# Altium project GREENBOX-ACC-J16-PVT2-TESTBOARD.PrjPCB
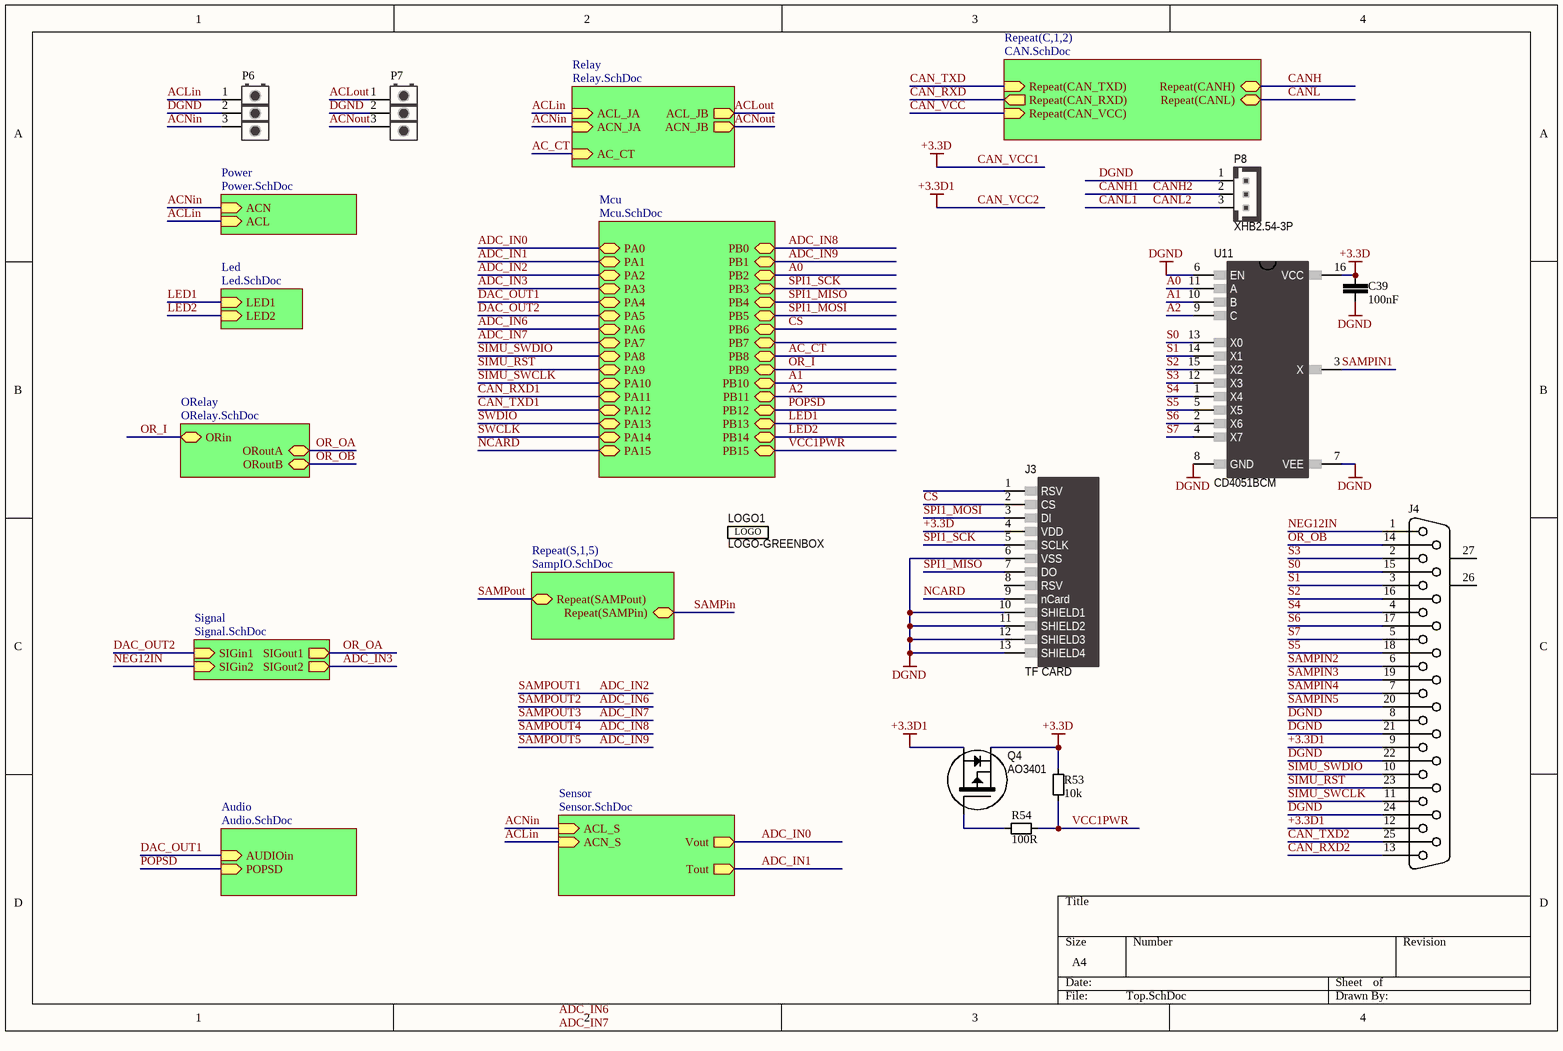
[diagram p0: Top.SchDoc]
11 sheets, 166 parts. Net scope: hierarchical (ports join the sheet entries above them; power ports are global).
Board file: J16-TESTBOARD.PcbDoc
Sheets:
  Top.SchDoc
    Mcu = Mcu.SchDoc
    Led = Led.SchDoc
    Power = Power.SchDoc
    ORelay = ORelay.SchDoc
    Sensor = Sensor.SchDoc
    C1 = CAN.SchDoc
    C2 = CAN.SchDoc
    Audio = Audio.SchDoc
    Signal = Signal.SchDoc
    Relay = Relay.SchDoc
    S1 = SampIO.SchDoc
    S2 = SampIO.SchDoc
    S3 = SampIO.SchDoc
    S4 = SampIO.SchDoc
    S5 = SampIO.SchDoc

## Sheet Top.SchDoc
size A4

### Parts
C39  value 100nF  [0603-C]  (hidden comment: Cap)
J3  TF CARD  [TF-2]
J4  DB25  [DB25F]  (value not drawn)
LOGO1  LOGO-GREENBOX  [LOGO-GREENBOX]
P6  KF7.62-3P  [KF762-3]  (value not drawn)
P7  KF7.62-3P  [KF762-3]  (value not drawn)
P8  XHB2.54-3P  [XH-3]
Q4  AO3401  [SOT-23_N]
R53  value 10k  [0603-R]  (hidden comment: Res)
R54  value 100R  [0603-R]  (hidden comment: Res)
U11  CD4051BCM  [SO-16_N]

### Sub-sheets
Audio = Audio.SchDoc: AUDIOin (in), POPSD (in)
Led = Led.SchDoc: LED1 (in), LED2 (in)
Mcu = Mcu.SchDoc: PA0, PA1, PA2, PA3, PA4, PA5, PA6, PA7, PA8, PA9, PA10, PA11, PA12, PA13, PA14, PA15, PB0, PB1, PB2, PB3, PB4, PB5, PB6, PB7, PB8, PB9, PB10, PB11, PB12, PB13, PB14, PB15
ORelay = ORelay.SchDoc: ORin, ORoutA, ORoutB
Power = Power.SchDoc: ACN (in), ACL (in)
Relay = Relay.SchDoc: ACL_JA (in), ACN_JA (in), ACL_JB (out), ACN_JB (out), AC_CT (in)
Repeat(C,1,2) = CAN.SchDoc: Repeat(CAN_TXD) (in), Repeat(CAN_RXD) (out), Repeat(CANH) (bidir), Repeat(CANL) (bidir), Repeat(CAN_VCC) (in)
Repeat(S,1,5) = SampIO.SchDoc: Repeat(SAMPout), Repeat(SAMPin)
Sensor = Sensor.SchDoc: Vout (out), Tout (out), ACL_S (in), ACN_S (in)
Signal = Signal.SchDoc: SIGin2 (in), SIGout1 (out), SIGin1 (in), SIGout2 (out)

### Nets
+3.3D: C39.1 J3.4(VDD) Q4.2(S) R53.1 U11.16(VCC)  [also labelled CAN_VCC1]
+3.3D1: J4.9 J4.12 Q4.3(D)  [also labelled CAN_VCC2]
DGND: C39.2 J3.6(VSS) J3.10(SHIELD1) J3.11(SHIELD2) J3.12(SHIELD3) J3.13(SHIELD4) J4.8 J4.21 J4.22 J4.24 P6.2 P7.2 P8.1 U11.6(EN) U11.7(VEE) U11.8(GND)
A0: U11.11(A) ; sheet Mcu/PB2
A1: U11.10(B) ; sheet Mcu/PB10
A2: U11.9(C) ; sheet Mcu/PB11
AC_CT: sheet Mcu/PB8, sheet Relay/AC_CT
ACLin: P6.1 ; sheet Power/ACL, sheet Sensor/ACN_S, sheet Relay/ACL_JA
ACLout: P7.1 ; sheet Relay/ACL_JB
ACNin: P6.3 ; sheet Power/ACN, sheet Sensor/ACL_S, sheet Relay/ACN_JA
ACNout: P7.3 ; sheet Relay/ACN_JB
ADC_IN0: sheet Mcu/PA0, sheet Sensor/Vout
ADC_IN1: sheet Mcu/PA1, sheet Sensor/Tout
ADC_IN3: sheet Mcu/PA3, sheet Signal/SIGout2
CAN_RXD: sheet Repeat(C,1,2)/Repeat(CAN_RXD)
CAN_RXD2: J4.13
CAN_TXD: sheet Repeat(C,1,2)/Repeat(CAN_TXD)
CAN_TXD2: J4.25
CAN_VCC: sheet Repeat(C,1,2)/Repeat(CAN_VCC)
CANH: sheet Repeat(C,1,2)/Repeat(CANH)
CANH1: P8.2  [also labelled CANH2]
CANL: sheet Repeat(C,1,2)/Repeat(CANL)
CANL1: P8.3  [also labelled CANL2]
CS: J3.2(CS) ; sheet Mcu/PB6
DAC_OUT1: sheet Mcu/PA4, sheet Audio/AUDIOin
DAC_OUT2: sheet Mcu/PA5, sheet Signal/SIGin1
LED1: sheet Mcu/PB13, sheet Led/LED1
LED2: sheet Mcu/PB14, sheet Led/LED2
NCARD: J3.9(nCard) ; sheet Mcu/PA15
NEG12IN: J4.1 ; sheet Signal/SIGin2
OR_I: sheet Mcu/PB9, sheet ORelay/ORin
OR_OA: sheet ORelay/ORoutA, sheet Signal/SIGout1
OR_OB: J4.14 ; sheet ORelay/ORoutB
POPSD: sheet Mcu/PB12, sheet Audio/POPSD
S0: J4.15 U11.13(X0)
S1: J4.3 U11.14(X1)
S2: J4.16 U11.15(X2)
S3: J4.2 U11.12(X3)
S4: J4.4 U11.1(X4)
S5: J4.18 U11.5(X5)
S6: J4.17 U11.2(X6)
S7: J4.5 U11.4(X7)
SAMPin: sheet Repeat(S,1,5)/Repeat(SAMPin)
SAMPIN1: U11.3(X)
SAMPIN2: J4.6
SAMPIN3: J4.19
SAMPIN4: J4.7
SAMPIN5: J4.20
SAMPout: sheet Repeat(S,1,5)/Repeat(SAMPout)
SIMU_RST: J4.23 ; sheet Mcu/PA9
SIMU_SWCLK: J4.11 ; sheet Mcu/PA10
SIMU_SWDIO: J4.10 ; sheet Mcu/PA8
SPI1_MISO: J3.7(DO) ; sheet Mcu/PB4
SPI1_MOSI: J3.3(DI) ; sheet Mcu/PB5
SPI1_SCK: J3.5(SCLK) ; sheet Mcu/PB3
VCC1PWR: R53.2 R54.2 ; sheet Mcu/PB15
NetQ4_1: Q4.1(G) R54.1

Not connected (* = marked no-connect by the designer): J3 1(RSV) 8(RSV); J4 26(MH1) 27(MH2)

### Notes on the sheet
- Labels drawn without touching a wire or pin: ADC_IN6, ADC_IN7
- (in symbol LOGO1) LOGO

### Library data of the parts
C39 = C21C100NK1H0: MLCC 100nF 10% 50V X7R 0603; TemperatureRange: -55°C to 150°C; VenderID: MLCC-0603-50V-104K-X7R; Published: 1-Jun-2017; Publisher: GreenBox; MountType: SMT; PackageReference: 0603; Manufacturer: *
J3 = M3DZTF2SPI00: TF CARD Pudsh-Push SPIMode; Manufacturer: TEXAS INSTRUMENTS; VenderID: TF卡座自弹式; Publisher: GreenBox; Published: 1-Jun-2017; PackageReference: TF-2; MountType: SMT; TemperatureRange: *
J4 = PDDD25Z27700: Receptacle Assembly DB25 Vertical; Publisher: GreenBox; Published: 1-Jan-2017; MountType: DIP; PackageReference: DB25F; VenderID: DB25 Vertical; TemperatureRange: *
LOGO1 = LOGO1: Resettable Fuse SMD1206P050TF 1206 500mA; Manufacturer: *; MountType: *; PackageDescription: *; PackageReference: *; Published: 1-Jun-2017; Publisher: GreenBox; TemperatureRange: *; VenderID: *
P6 P7 = PKDK03Z76200: Header KF7.62-3P 7.62mm; Publisher: GreenBox; Published: 1-Jan-2017; MountType: DIP; PackageReference: KF7.62-3P; VenderID: KF7.62-3P; TemperatureRange: *
P8 = P6DX03Z25400: Header XHB2.54-3P 2.54mm; TemperatureRange: -25 to 85°C; Manufacturer: *; MountType: DIP; PackageReference: XH2.54-3P; Published: 1-Jun-2017; Publisher: GreenBox; VenderID: XHB2.54-3P
Q4 = QP42AO34010A: P-Channel MOSFET AO3401 -30V -4.2A; Manufacturer: ALPHA&OMEGA; TemperatureRange: -55 to 150°C; MountType: SMT; PackageReference: SOT-23; Published: 1-Jun-2017; Publisher: GreenBox; VenderID: AO3401
R53 = R11C010KFBF0: SMD Resistor 10k 1% 1/10W 0603 100PPM; TemperatureRange: -55°C to 150°C; VenderID: RES-0603-10k-1%; Published: 1-Jun-2017; Publisher: GreenBox; MountType: SMT; PackageReference: 0603; Manufacturer: *
R54 = R11C100RFBF0: SMD Resistor 100R 1% 1/10W 0603 100PPM; TemperatureRange: -55°C to 150°C; VenderID: RES-0603-100R-1%; Published: 1-Jun-2017; Publisher: GreenBox; MountType: SMT; PackageReference: 0603; Manufacturer: *
U11 = UCS3CD4051B0: SGL ENDED MULTIPLEXER CD4051BCM 8-CHANNEL; TemperatureRange: -55 to 125°C; Manufacturer: *; MountType: SMT; PackageReference: SOIC-16; Published: 1-Jun-2017; Publisher: GreenBox; VenderID: CD4051BCM

## Sheet Mcu.SchDoc
size A4
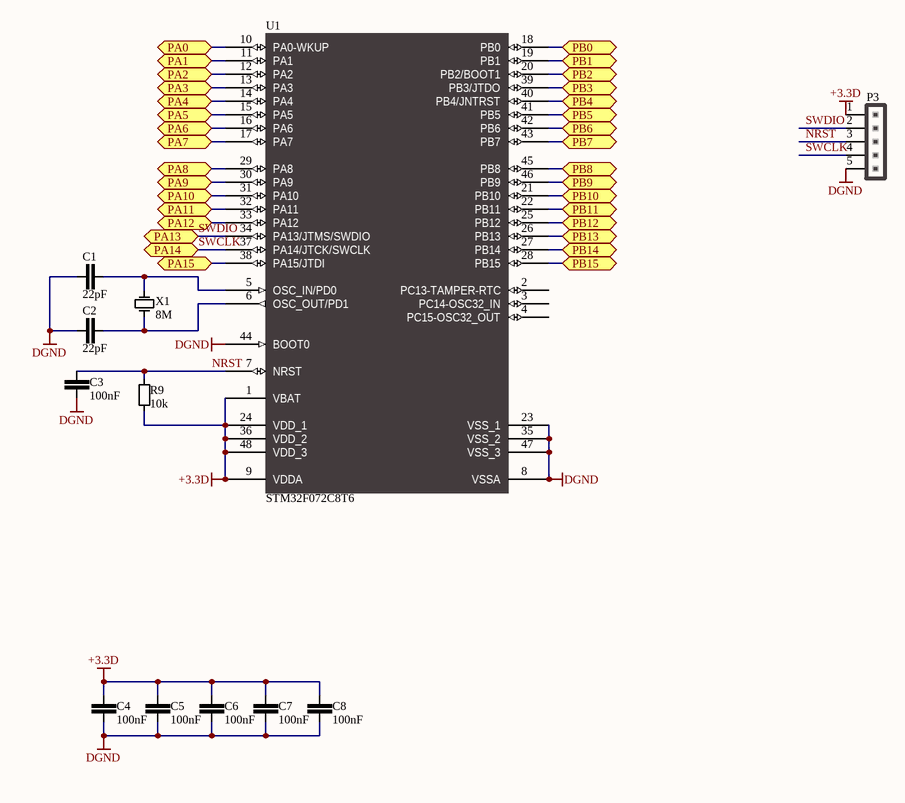
[diagram p1: Mcu.SchDoc]

### Parts
C1  value 22pF  [0603-C]  (hidden comment: Cap)
C2  value 22pF  [0603-C]  (hidden comment: Cap)
C3  value 100nF  [0603-C]  (hidden comment: Cap)
C4  value 100nF  [0603-C]  (hidden comment: Cap)
C5  value 100nF  [0603-C]  (hidden comment: Cap)
C6  value 100nF  [0603-C]  (hidden comment: Cap)
C7  value 100nF  [0603-C]  (hidden comment: Cap)
C8  value 100nF  [0603-C]  (hidden comment: Cap)
P3  Header 5  [HDR-1X5]  (value not drawn)
R9  value 10k  [0603-R]  (hidden comment: Res)
U1  STM32F072C8T6  [LQFP48_N]
X1  value 8M  [5032]  (hidden comment: Crystal)

### Ports
PA0, PA1, PA2, PA3, PA4, PA5, PA6, PA7, PA8, PA9, PA10, PA11, PA12, PA13, PA14, PA15, PB0, PB1, PB2, PB3, PB4, PB5, PB6, PB7, PB8, PB9, PB10, PB11, PB12, PB13, PB14, PB15

### Nets
+3.3D: C4.1 C5.1 C6.1 C7.1 C8.1 P3.1 R9.2 U1.1(VBAT) U1.9(VDDA) U1.24(VDD_1) U1.36(VDD_2) U1.48(VDD_3)
DGND: C1.1 C2.1 C3.1 C4.2 C5.2 C6.2 C7.2 C8.2 P3.5 U1.8(VSSA) U1.23(VSS_1) U1.35(VSS_2) U1.44(BOOT0) U1.47(VSS_3)
A0: U1.20(PB2/BOOT1) ; port PB2
A1: U1.21(PB10) ; port PB10
A2: U1.22(PB11) ; port PB11
AC_CT: U1.45(PB8) ; port PB8
ADC_IN0: U1.10(PA0-WKUP) ; port PA0
ADC_IN1: U1.11(PA1) ; port PA1
ADC_IN2: U1.12(PA2) ; port PA2
ADC_IN3: U1.13(PA3) ; port PA3
ADC_IN6: U1.16(PA6) ; port PA6
ADC_IN7: U1.17(PA7) ; port PA7
ADC_IN8: U1.18(PB0) ; port PB0
ADC_IN9: U1.19(PB1) ; port PB1
CAN_RXD1: U1.32(PA11) ; port PA11
CAN_TXD1: U1.33(PA12) ; port PA12
CS: U1.42(PB6) ; port PB6
DAC_OUT1: U1.14(PA4) ; port PA4
DAC_OUT2: U1.15(PA5) ; port PA5
LED1: U1.26(PB13) ; port PB13
LED2: U1.27(PB14) ; port PB14
NCARD: U1.38(PA15/JTDI) ; port PA15
NRST: C3.2 P3.3 R9.1 U1.7(NRST)
OR_I: U1.46(PB9) ; port PB9
POPSD: U1.25(PB12) ; port PB12
SIMU_RST: U1.30(PA9) ; port PA9
SIMU_SWCLK: U1.31(PA10) ; port PA10
SIMU_SWDIO: U1.29(PA8) ; port PA8
SPI1_MISO: U1.40(PB4/JNTRST) ; port PB4
SPI1_MOSI: U1.41(PB5) ; port PB5
SPI1_SCK: U1.39(PB3/JTDO) ; port PB3
SWCLK: P3.4 U1.37(PA14/JTCK/SWCLK) ; port PA14
SWDIO: P3.2 U1.34(PA13/JTMS/SWDIO) ; port PA13
VCC1PWR: U1.28(PB15) ; port PB15
NetC1_2: C1.2 U1.5(OSC_IN/PD0) X1.2(OSC2)
NetC2_2: C2.2 U1.6(OSC_OUT/PD1) X1.1(OSC1)
NetU1_43: U1.43(PB7) ; port PB7

Not connected (* = marked no-connect by the designer): U1 2(PC13-TAMPER-RTC) 3(PC14-OSC32_IN) 4(PC15-OSC32_OUT)

### Library data of the parts
C1 C2 = C11C022PJ1H0: MLCC 22pF 5% 50V NPO 0603; TemperatureRange: -55°C to 150°C; VenderID: MLCC-0603-50V-220J-NPO; Published: 1-Jun-2017; Publisher: GreenBox; MountType: SMT; PackageReference: 0603; Manufacturer: *
C3-C8 = C21C100NK1H0: as C39 on sheet Top; Published: 1-Jun-2017; Publisher: GreenBox; MountType: SMT; PackageReference: 0603; Manufacturer: *
P3 = P1D105Z254D0: Header 5-Pin Pitch 2.54mm Height 11mm; VenderID: 单排针2.54mm针长11mm; Publisher: GreenBox; Published: 1-Jun-2017; MountType: DIP; PackageReference: HDR5X1; TemperatureRange: *; Manufacturer: *
R9 = R11c010KFBF0: SMD Resistor 10k 1% 1/10W 0603 100PPM; TemperatureRange: -55°C to 150°C; VenderID: RES-0603-10k-1%; Published: 1-Jun-2017; Publisher: GreenBox; MountType: SMT; PackageReference: 0603; Manufacturer: *
U1 = UML3072C8T6S: ARM CORTEXM3 STM32F072C8T6; Manufacturer: ST; TemperatureRange: -40 to 85°C; Published: 1-Jun-2017; PackageReference: LQFP48; Publisher: GreenBox; PackageDescription: Thin QFP, 48-Leads, Body 7x7mm, Pitch 0.5mm; MountType: SMT; VenderID: STM32F072C8T6
X1 = XC23000008M1: Crystal 8M 5032 50PPM; Manufacturer: NDK; VenderID: NX5032GA-8.000M-STD-CSU-1; TemperatureRange: -40 to 150°C; PackageReference: 5032; Publisher: GreenBox; Published: 1-Jun-2017; MountType: SMT; PackageDescription: 5032; Body 5.0 x 3.2 x 1.2 mm

## Sheet Led.SchDoc
size A4
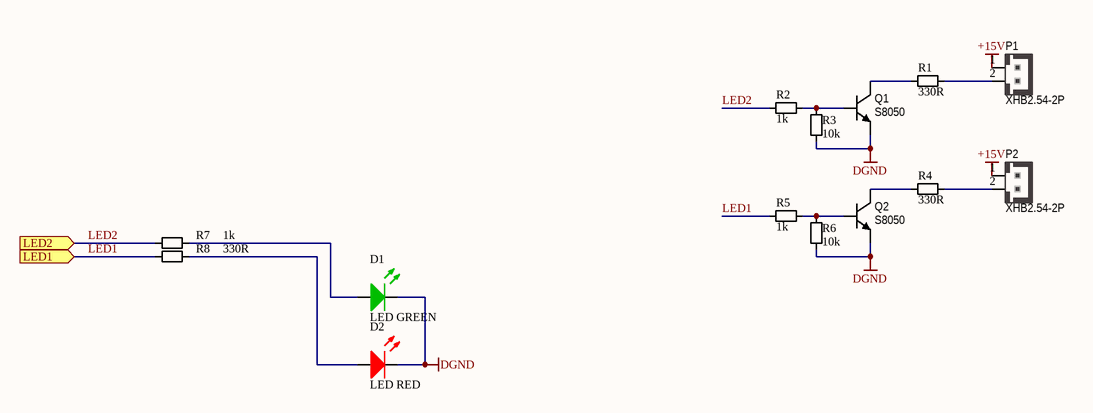
[diagram p2: Led.SchDoc]

### Parts
D1  LED GREEN  [0805-LED-G]
D2  LED RED  [0805-LED-R]
P1  XHB2.54-2P  [XH-2]
P2  XHB2.54-2P  [XH-2]
Q1  S8050  [SOT-23_N]
Q2  S8050  [SOT-23_N]
R1  value 330R  [0603-R]  (hidden comment: Res)
R2  value 1k  [0603-R]  (hidden comment: Res)
R3  value 10k  [0603-R]  (hidden comment: Res)
R4  value 330R  [0603-R]  (hidden comment: Res)
R5  value 1k  [0603-R]  (hidden comment: Res)
R6  value 10k  [0603-R]  (hidden comment: Res)
R7  value 1k  [0603-R]  (hidden comment: Res)
R8  value 330R  [0603-R]  (hidden comment: Res)

### Ports
LED1 (in), LED2 (in)

### Nets
+15V: P1.1 P2.1
DGND: D1.2 D2.2 Q1.2(E) Q2.2(E) R3.2 R6.2
LED1: R5.1 R8.1 ; port LED1
LED2: R2.1 R7.1 ; port LED2
NetD1_1: D1.1 R7.2
NetD2_1: D2.1 R8.2
NetP1_2: P1.2 R1.2
NetP2_2: P2.2 R4.2
NetQ1_1: Q1.1(B) R2.2 R3.1
NetQ1_3: Q1.3(C) R1.1
NetQ2_1: Q2.1(B) R5.2 R6.1
NetQ2_3: Q2.3(C) R4.1

### Library data of the parts
D1 = D614000000G0: LIGHT EMITTING DIODE 0805 GREEN; TemperatureRange: -30 to 85°C; VenderID: LED-0805-GREEN; Published: 1-Jun-2017; Publisher: GreenBox; PackageReference: 0805; MountType: SMT; Manufacturer: *
D2 = D614000000R0: LIGHT EMITTING DIODE 0805 RED; TemperatureRange: -30 to 85°C; VenderID: LED-0805-RED; Published: 1-Jun-2017; Publisher: GreenBox; PackageReference: 0805; MountType: SMT; Manufacturer: *
P1 P2 = P6DX02Z25400: Header XHB2.54-2P 2.54mm; TemperatureRange: -25 to 85°C; Manufacturer: *; MountType: DIP; PackageReference: XH2.54-2P; Published: 1-Jun-2017; Publisher: GreenBox; VenderID: XHB2.54-2P
Q1 Q2 = DN42S8050000: NPN S8050 Icm 0.5A Vcbo 40V; TemperatureRange: -55 to 150°C; Manufacturer: *; MountType: SMT; PackageReference: SOT-23; Published: 1-Jun-2017; Publisher: GreenBox; VenderID: S8050
R1 R4 R8 = R11C330RFBF0: SMD Resistor 330R 1% 1/10W 0603 100PPM; TemperatureRange: -55°C to 150°C; VenderID: RES-0603-330R-1%; Published: 1-Jun-2017; Publisher: GreenBox; MountType: SMT; PackageReference: 0603; Manufacturer: *
R2 R5 R7 = R11C001kFBF0: SMD Resistor 1k 1% 1/10W 0603 100PPM; TemperatureRange: -55°C to 150°C; VenderID: RES-0603-1k-1%; Published: 1-Jun-2017; Publisher: GreenBox; MountType: SMT; PackageReference: 0603; Manufacturer: *
R3 R6 = R11C010KFBF0: as R53 on sheet Top; Published: 1-Jun-2017; Publisher: GreenBox; MountType: SMT; PackageReference: 0603; Manufacturer: *

## Sheet Power.SchDoc
size A4
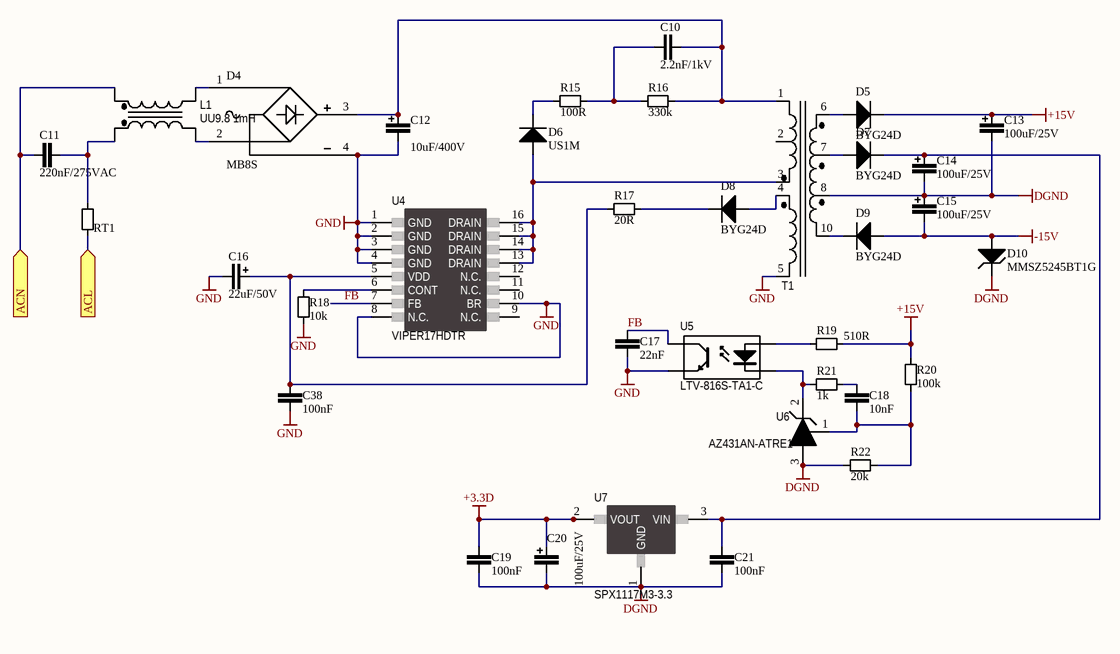
[diagram p3: Power.SchDoc]

### Parts
C10  value 2.2nF/1kV  [1206-C]  (hidden comment: High-Volt Cap)
C11  value 220nF/275VAC  [C-F-C3]  (hidden comment: FILM Cap)
C12  value 10uF/400V  [C-E-ALU-10X16]  (hidden comment: ECap)
C13  value 100uF/25V  [C-E-ALU-6.3X11.5]  (hidden comment: ECap)
C14  value 100uF/25V  [C-E-ALU-6.3X11.5]  (hidden comment: ECap)
C15  value 100uF/25V  [C-E-ALU-6.3X11.5]  (hidden comment: ECap)
C16  value 22uF/50V  [C-E-ALU-5X11]  (hidden comment: ECap)
C17  value 22nF  [0603-C]  (hidden comment: Cap)
C18  value 10nF  [0603-C]  (hidden comment: Cap)
C19  value 100nF  [0603-C]  (hidden comment: Cap)
C20  value 100uF/25V  [C-E-ALU-6.3X11.5]  (hidden comment: ECap)
C21  value 100nF  [0603-C]  (hidden comment: Cap)
C38  value 100nF  [0603-C]  (hidden comment: Cap)
D4  MB8S  [MBS-1]
D5  BYG24D  [DO-214AC]
D6  US1M  [DO-214AC]
D7  BYG24D  [DO-214AC]
D8  BYG24D  [DO-214AC]
D9  BYG24D  [DO-214AC]
D10  MMSZ5245BT1G  [SOD-123]
L1  UU9.8 1mH  [UU9_8]
R15  value 100R  [1206-R]  (hidden comment: Res)
R16  value 330k  [1206-R]  (hidden comment: Res)
R17  value 20R  [1206-R]  (hidden comment: Res)
R18  value 10k  [0603-R]  (hidden comment: Res)
R19  value 510R  [0603-R]  (hidden comment: Res)
R20  value 100k  [0603-R]  (hidden comment: Res)
R21  value 1k  [0603-R]  (hidden comment: Res)
R22  value 20k  [0603-R]  (hidden comment: Res)
RT1  SY16P  [PTC-16P]  (value not drawn)
T1  Transformer  [EE13-5+5-Q9]  (value not drawn)
U4  VIPER17HDTR  [SO-16_N]
U5  LTV-816S-TA1-C  [DIP-4-SMD-OPTO]
U6  AZ431AN-ATRE1  [SOT-23_N]
U7  SPX1117M3-3.3  [SOT223_N]

### Ports
ACL (in), ACN (in)

### Nets
+3.3D: C19.1 C20.1 U7.2(VOUT) U7.4(VOUT)
+15V: C13.1 D5.2(K) R19.1 R20.2
-15V: C15.2 D9.1(A) D10.1(A)
DGND: C13.2 C14.2 C15.1 C19.2 C20.2 C21.1 D10.2(K) R22.2 T1.8 U6.3(IN-) U7.1(GND)
GND: C12.2 C16.2 C17.2 C38.2 D4.4(-) R18.2 T1.5 U4.1(GND) U4.2(GND) U4.3(GND) U4.4(GND) U4.8(N.C.) U4.10(BR) U5.3(E)
ACLin: RT1.1 ; port ACL
ACNin: C11.1 L1.3(Sec+) ; port ACN
FB: C17.1 U4.7(FB) U5.4(C)
NetC10_1: C10.1 R15.2 R16.2
NetC10_2: C10.2 C12.1 D4.3(+) R16.1 T1.1
NetC11_2: C11.2 L1.1(Pri+) RT1.2
NetC14_1: C14.1 C21.2 D7.2(K) U7.3(VIN)
NetC16_1: C16.1 C38.1 R17.1 U4.5(VDD)
NetC18_1: C18.1 R21.2
NetC18_2: C18.2 R20.1 R22.1 U6.1(OUT)
NetD4_1: D4.1(AC) L1.4(Sec-)
NetD4_2: D4.2(AC) L1.2(Pri-)
NetD5_1: D5.1(A) T1.6
NetD6_1: D6.1(A) T1.3 U4.13(DRAIN) U4.14(DRAIN) U4.15(DRAIN) U4.16(DRAIN)
NetD6_2: D6.2(K) R15.1
NetD7_1: D7.1(A) T1.7
NetD8_1: D8.1(A) T1.4
NetD8_2: D8.2(K) R17.2
NetD9_2: D9.2(K) T1.10
NetR18_1: R18.1 U4.6(CONT)
NetR19_2: R19.2 U5.1(A)
NetR21_1: R21.1 U5.2(K) U6.2(IN+)

Not connected (* = marked no-connect by the designer): T1 2; U4 9(N.C.) 11(N.C.) 12(N.C.)

### Library data of the parts
C10 = C21E02N2K3A0: MLCC 2.2nF 10% 1000V X7R 1206; TemperatureRange: -55°C to 150°C; VenderID: MLCC-1206-1000V-222K-X7R; Published: 1-Jun-2017; Publisher: GreenBox; MountType: SMT; PackageReference: 1206; Manufacturer: *
C11 = CXDM220NKAC0: FILM CAP 220nF 10% 275VAC MPX X2 10mm; TemperatureRange: -40°C to 110°C; Published: 1-Jun-2017; Publisher: GreenBox; MountType: DIP; PackageReference: C3; VenderID: *; Manufacturer: *; PackageDescription: C3, Body 13x6mm, Pitch 10mm
C12 = C3AE010UM2G0: DIP ECAP 10uF 20% 400V 10X16; TemperatureRange: -40°C to 105°C; VenderID: 10uF/400V 20% 10X16; Published: 1-Jun-2017; Publisher: GreenBox; MountType: DIP; PackageReference: 10X16; Manufacturer: *
C13-C15 C20 = C3AC100UM1E0: DIP ECAP 100uF 20% 25V 6.3X11.5; TemperatureRange: -40°C to 105°C; VenderID: 100uF/25V 20% 6.3X11.5; Published: 1-Jun-2017; Publisher: GreenBox; MountType: DIP; PackageReference: 6.3X11.5; Manufacturer: *
C16 = C3AB022UM1H0: DIP ECAP 22uF 20% 50V 5X11; TemperatureRange: -40°C to 105°C; VenderID: 22uF/50V 20% 5X11; Published: 1-Jun-2017; Publisher: GreenBox; MountType: DIP; PackageReference: 5X11; Manufacturer: *
C17 = C21C022NK1H0: MLCC 22nF 10% 50V X7R 0603; TemperatureRange: -55°C to 150°C; VenderID: MLCC-0603-50V-223K-X7R; Published: 1-Jun-2017; Publisher: GreenBox; MountType: SMT; PackageReference: 0603; Manufacturer: *
C18 = C21C010NK1H0: MLCC 10nF 10% 50V X7R 0603; TemperatureRange: -55°C to 150°C; VenderID: MLCC-0603-50V-103K-X7R; Published: 1-Jun-2017; Publisher: GreenBox; MountType: SMT; PackageReference: 0603; Manufacturer: *
C19 C21 C38 = C21C100NK1H0: as C39 on sheet Top; Published: 1-Jun-2017; Publisher: GreenBox; MountType: SMT; PackageReference: 0603; Manufacturer: *
D4 = DBSAMB8S0000: Bridge Rectifiers MB8S 800V 0.5A; Manufacturer: ON SEMICONDUCTOR; TemperatureRange: -55°C to 150°C; Published: 1-Jun-2017; Publisher: GreenBox; PackageReference: MBS-1; MountType: SMT; VenderID: MB8S
D5 D7-D9 = D461BYG24D0V: Fast Recovery Rectifiers BYG24D Vrrm 200V If 1.5A 140nS; Manufacturer: VISHAY; TemperatureRange: -55°C to 150°C; Published: 1-Jun-2017; Publisher: GreenBox; PackageReference: DO-214AC; MountType: SMT; VenderID: BYG24D
D6 = D461US1M0000: Fast Recovery Rectifiers US1M Vrrm 1000V If 1A 75nS; TemperatureRange: -65°C to 150°C; Published: 1-Jun-2017; Publisher: GreenBox; PackageReference: DO-214AC; MountType: SMT; VenderID: US1M; Manufacturer: *
D10 = D531MSZ5245O: Zener Voltage Regulators MMSZ5245BT1G 15V 0W5; Manufacturer: ON SEMICONDUCTOR; TemperatureRange: -55°C to 150°C; Published: 1-Jun-2017; Publisher: GreenBox; PackageReference: SOD-123; MountType: SMT; VenderID: MMSZ5245BT1G
L1 = LCDZUU9801M0: Common Mode Inductor UU9.8 1mH 1A; TemperatureRange: -25 to 80°C; MountType: SMT; Manufacturer: *; PackageReference: UU9_8; Published: 1-Jun-2017; Publisher: GreenBox; VenderID: UU9.8 1mH
R15 = R11E100RFDF0: SMD Resistor 100R 1% 1/4W 1206 100PPM; TemperatureRange: -55°C to 150°C; VenderID: RES-1206-100R-1%; Published: 1-Jun-2017; Publisher: GreenBox; MountType: SMT; PackageReference: 1206; Manufacturer: *
R16 = R11E330KFDF0: SMD Resistor 330k 1% 1/4W 1206 100PPM; TemperatureRange: -55°C to 150°C; VenderID: RES-1206-330k-1%; Published: 1-Jun-2017; Publisher: GreenBox; MountType: SMT; PackageReference: 1206; Manufacturer: *
R17 = R11E020RFDF0: SMD Resistor 20R 1% 1/4W 1206 100PPM; TemperatureRange: -55°C to 150°C; VenderID: RES-1206-20R-1%; Published: 1-Jun-2017; Publisher: GreenBox; MountType: SMT; PackageReference: 1206; Manufacturer: *
R18 = R11C010KFBF0: as R53 on sheet Top; Published: 1-Jun-2017; Publisher: GreenBox; MountType: SMT; PackageReference: 0603; Manufacturer: *
R19 = R11C510RFBF0: SMD Resistor 510R 1% 1/10W 0603 100PPM; TemperatureRange: -55°C to 150°C; VenderID: RES-0603-510R-1%; Published: 1-Jun-2017; Publisher: GreenBox; MountType: SMT; PackageReference: 0603; Manufacturer: *
R20 = R11C100KFBF0: SMD Resistor 100k 1% 1/10W 0603 100PPM; TemperatureRange: -55°C to 150°C; VenderID: RES-0603-100k-1%; Published: 1-Jun-2017; Publisher: GreenBox; MountType: SMT; PackageReference: 0603; Manufacturer: *
R21 = R11C001KFBF0: SMD Resistor 1k 1% 1/10W 0603 100PPM; TemperatureRange: -55°C to 150°C; VenderID: RES-0603-1k-1%; Published: 1-Jun-2017; Publisher: GreenBox; MountType: SMT; PackageReference: 0603; Manufacturer: *
R22 = R11C020KFBF0: SMD Resistor 20k 1% 1/10W 0603 100PPM; TemperatureRange: -55°C to 150°C; VenderID: RES-0603-20k-1%; Published: 1-Jun-2017; Publisher: GreenBox; MountType: SMT; PackageReference: 0603; Manufacturer: *
RT1 = RPDZSY16P000: PTC SY16P; Published: 1-Jun-2017; Publisher: GreenBox; PackageReference: PTC-16P; MountType: DIP; VenderID: PTC SY16P; TemperatureRange: *; Manufacturer: *
T1 = MTD5220050A0: Transformer EE13 GREENBOX 16A Auxiliary Power; Publisher: GreenBox; MountType: DIP; PackageReference: EE13; Published: 1-Jun-2017; TemperatureRange: *; Manufacturer: *; PackageDescription: *; VenderID: *
U4 = UDS3VIPER17S: Switching Regulator VIPER17HDTR 127kHz; Manufacturer: STMicroelectronics; MountType: SMT; PackageReference: SO-16; Published: 1-Jun-2017; Publisher: GreenBox; TemperatureRange: *; VenderID: VIPER17HDTR
U5 = UOSBLTV816SI: Phototransistor Optocoupler LTV-816S-TA1-C Viso 5000Vrms; Manufacturer: LITE-ON ELECTRONICS; TemperatureRange: -30°C to 100°C; MountType: SMT; PackageDescription: DIP-4-SMD-OPTO; 4 Leads; Row Spacing 9mm; Pitch 2.54 mm; PackageReference: LTV-816S; Published: 1-Jun-2017; Publisher: GreenBox; VenderID: LTV-816S-TA1-C
U6 = UV42AZ431ANB: Voltage Reference AZ431AN-ATRE1 Vref 2.5V; Manufacturer: BCD SEMICONDUCTOR; TemperatureRange: -40 to 125°C; Publisher: GreenBox; Published: 1-Jun-2017; MountType: SMT; PackageReference: SOT-23; VenderID: AZ431AN-ATRE1
U7 = UL4111173V3E: LDO SPX1117M3-3.3 3V3 800mA; Manufacturer: SIPEX CORPORATION; TemperatureRange: -40°C to 125°C; Publisher: GreenBox; Published: 1-Jun-2017; PackageReference: SOT-223; MountType: SMT; VenderID: SPX1117M3-3.3

## Sheet ORelay.SchDoc
size A4
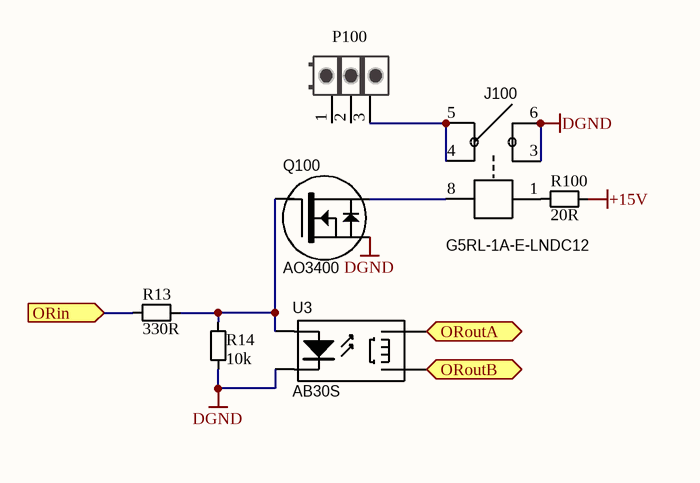
[diagram p4: ORelay.SchDoc]

### Parts
J100  G5RL-1A-E-LNDC12  [G5RL-1A-E]
P100  KF7.62-3P  [KF762-3]  (value not drawn)
Q100  AO3400  [SOT-23_N]
R13  value 330R  [0603-R]  (hidden comment: Res)
R14  value 10k  [0603-R]  (hidden comment: Res)
R100  value 20R  [1206-R]  (hidden comment: Res)
U3  AB30S  [TOWARD-SOP-4]

### Ports
ORin (in), ORoutA (out), ORoutB (out)

### Nets
+15V: R100.2
DGND: J100.3 J100.6 Q100.2(S) R14.2 U3.2(K)
OR_I: R13.1 ; port ORin
OR_OA: U3.4(C) ; port ORoutA
OR_OB: U3.3(E) ; port ORoutB
NetJ100_1: J100.1 R100.1
NetJ100_4: J100.4 J100.5 P100.3
NetJ100_8: J100.8 Q100.3(D)
NetQ100_1: Q100.1(G) R13.2 R14.1 U3.1(A)

Not connected (* = marked no-connect by the designer): P100 1 2

### Library data of the parts
J100 = JNDZG5RL1122: Power/Signal Relay G5RL-1A-E-LNDC12 16A 250VAC 12VDC; Manufacturer: OMRON; TemperatureRange: -40 to 70°C; MountType: DIP; PackageReference: G5RL-1A-E; Published: 1-Jun-2017; Publisher: GreenBox; VenderID: G5RL-1A-E-LNDC12
P100 = PKDK03Z76200: Header KF7.62-3P 7.62mm; Publisher: GreenBox; Published: 1-Jan-2017; MountType: DIP; PackageReference: KF7.62-3P; VenderID: KF7.62-3P; TemperatureRange: *
Q100 = QN42AO34000A: N-Channel MOSFET AO3400 30V 5.8A; Manufacturer: ALPHA&OMEGA; TemperatureRange: -55 to 150°C; MountType: SMT; PackageReference: SOT-23; Published: 1-Jun-2017; Publisher: GreenBox; VenderID: AO3400
R13 = R11C330RFBF0: as R1 on sheet Led; Published: 1-Jun-2017; Publisher: GreenBox; MountType: SMT; PackageReference: 0603; Manufacturer: *
R14 = R11C010KFBF0: as R53 on sheet Top; Published: 1-Jun-2017; Publisher: GreenBox; MountType: SMT; PackageReference: 0603; Manufacturer: *
R100 = R11E020RFDF0: as R17 on sheet Power; Published: 1-Jun-2017; Publisher: GreenBox; MountType: SMT; PackageReference: 1206; Manufacturer: *
U3 = UPSCAB30S00W: Solid State Optronics Relay AB30S 100mA 400V 24Ω; Manufacturer: TOWARD; TemperatureRange: -40°C to 85°C; MountType: SMT; PackageDescription: SOP-4 Pitch 2.54mm; PackageReference: TOWARD-SOP-4; Published: 1-Jun-2017; Publisher: GreenBox; VenderID: AB30S

## Sheet Sensor.SchDoc
size A4
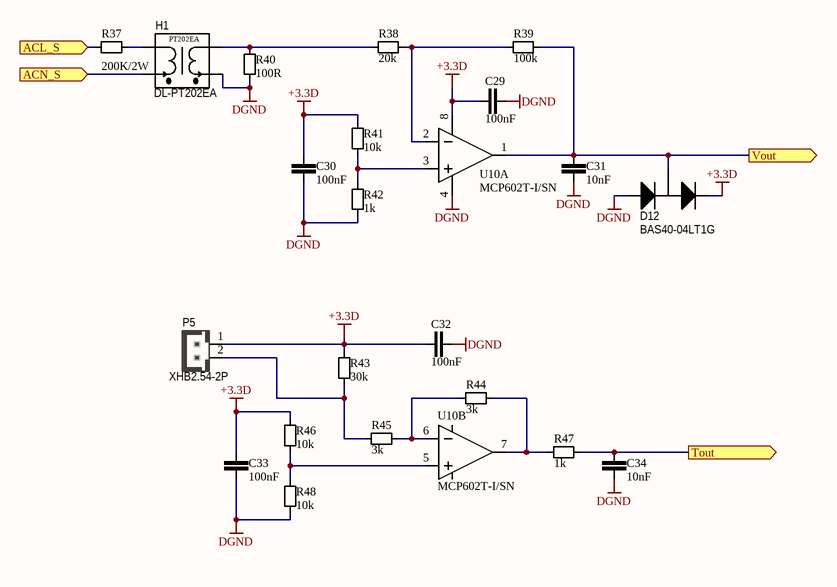
[diagram p5: Sensor.SchDoc]

### Parts
C29  value 100nF  [0603-C]  (hidden comment: Cap)
C30  value 100nF  [0603-C]  (hidden comment: Cap)
C31  value 10nF  [0603-C]  (hidden comment: Cap)
C32  value 100nF  [0603-C]  (hidden comment: Cap)
C33  value 100nF  [0603-C]  (hidden comment: Cap)
C34  value 10nF  [0603-C]  (hidden comment: Cap)
D12  BAS40-04LT1G  [SOT-23_N]
H1  DL-PT202EA  [DL-PT202EA]
P5  XHB2.54-2P  [XH-2]
R37  value 200K/2W  [AXIAL-5mm]  (hidden comment: Res)
R38  value 20k  [0603-R]  (hidden comment: Res)
R39  value 100k  [0603-R]  (hidden comment: Res)
R40  value 100R  [0603-R]  (hidden comment: Res)
R41  value 10k  [0603-R]  (hidden comment: Res)
R42  value 1k  [0603-R]  (hidden comment: Res)
R43  value 30k  [0603-R]  (hidden comment: Res)
R44  value 3k  [0603-R]  (hidden comment: Res)
R45  value 3k  [0603-R]  (hidden comment: Res)
R46  value 10k  [0603-R]  (hidden comment: Res)
R47  value 1k  [0603-R]  (hidden comment: Res)
R48  value 10k  [0603-R]  (hidden comment: Res)
U10  MCP602T-I/SN  [SO-8_N]  (parts A,B of 2)

### Ports
ACL_S (in), ACN_S (in), Tout (out), Vout (out)

### Nets
+3.3D: C29.1 C30.1 C32.1 C33.1 D12.2(K) P5.1 R41.1 R43.1 R46.1 U10.8
DGND: C29.2 C30.2 C31.2 C32.2 C33.2 C34.2 D12.1(A) H1.4 R40.1 R42.1 R48.2 U10.4
ACLin: H1.1 ; port ACN_S
ACNin: R37.1 ; port ACL_S
ADC_IN0: C31.1 D12.3(C) R39.2 U10.1 ; port Vout
ADC_IN1: C34.1 R47.2 ; port Tout
NetH1_2: H1.2 R37.2
NetH1_3: H1.3 R38.2 R40.2
NetP5_2: P5.2 R43.2 R45.1
NetR38_1: R38.1 R39.1 U10.2
NetR41_2: R41.2 R42.2 U10.3
NetR44_1: R44.1 R45.2 U10.6
NetR44_2: R44.2 R47.1 U10.7
NetR46_2: R46.2 R48.1 U10.5

### Notes on the sheet
- (in symbol H1DZPT202EAX) PT202EA

### Library data of the parts
C29 C30 C32 C33 = C21C100NK1H0: as C39 on sheet Top; Published: 1-Jun-2017; Publisher: GreenBox; MountType: SMT; PackageReference: 0603; Manufacturer: *
C31 C34 = C21C010NK1H0: as C18 on sheet Power; Published: 1-Jun-2017; Publisher: GreenBox; MountType: SMT; PackageReference: 0603; Manufacturer: *
D12 = D742BAS4004O: Dual Series Schottky Barrier Diode BAS40-04LT1G Vrrm 40V If 0.12A Ir 1uA; Manufacturer: ON SEMICONDUCTOR; TemperatureRange: -55 to 150°C; MountType: SMT; PackageReference: SOT-23; Published: 1-Jun-2017; Publisher: GreenBox; VenderID: BAS40-04LT1G
H1 = H1DZPT202EAX: Voltage Transformer DL-PT202EA 2mA/2mA 0.1; Manufacturer: 南京向上电子科技有限公司; TemperatureRange: -35 to 70°C; MountType: DIP; PackageReference: DL-PT202EA; Published: 1-Jun-2017; Publisher: GreenBox; VenderID: DL-PT202EA
P5 = P6DX02Z25400: as P1 on sheet Led; Manufacturer: *; MountType: DIP; PackageReference: XH2.54-2P; Published: 1-Jun-2017; Publisher: GreenBox; VenderID: XHB2.54-2P
R37 = RMDA200KFGF0: Metal Film Resistor 200KR 1% 2W0 AXIAL 100PPM; TemperatureRange: -55°C to 150°C; VenderID: 200K-2W-1%; Published: 1-Jun-2017; Publisher: GreenBox; MountType: DIP; PackageReference: AXIAL; Manufacturer: *
R38 = R11C020KFBF0: as R22 on sheet Power; Published: 1-Jun-2017; Publisher: GreenBox; MountType: SMT; PackageReference: 0603; Manufacturer: *
R39 = R11C100KFBF0: as R20 on sheet Power; Published: 1-Jun-2017; Publisher: GreenBox; MountType: SMT; PackageReference: 0603; Manufacturer: *
R40 = R11C100RFBF0: as R54 on sheet Top; Published: 1-Jun-2017; Publisher: GreenBox; MountType: SMT; PackageReference: 0603; Manufacturer: *
R41 R46 R48 = R11C010KFBF0: as R53 on sheet Top; Published: 1-Jun-2017; Publisher: GreenBox; MountType: SMT; PackageReference: 0603; Manufacturer: *
R42 R47 = R11C001KFBF0: as R21 on sheet Power; Published: 1-Jun-2017; Publisher: GreenBox; MountType: SMT; PackageReference: 0603; Manufacturer: *
R43 = R11C030KFBF0: SMD Resistor 30k 1% 1/10W 0603 100PPM; TemperatureRange: -55°C to 150°C; VenderID: RES-0603-30k-1%; Published: 1-Jun-2017; Publisher: GreenBox; MountType: SMT; PackageReference: 0603; Manufacturer: *
R44 R45 = R11C003KFBF0: SMD Resistor 3k 1% 1/10W 0603 100PPM; TemperatureRange: -55°C to 150°C; VenderID: RES-0603-3k-1%; Published: 1-Jun-2017; Publisher: GreenBox; MountType: SMT; PackageReference: 0603; Manufacturer: *
U10 = UOS1MCP602IM: Dual Rail To Rail Operational Amplifier MCP602T-I/SN Vcc 2.7V~5.5V Vio 2mV; Manufacturer: MICROCHIP; VenderID: MCP602T-E/SN; TemperatureRange: -40°C to 85°C; Publisher: GreenBox; Published: 1-Jan-2016; PackageReference: SOIC(8); MountType: SMT; PackageDescription: 8-Pin Small Outline Integrated Circuit 1.27 mm Pitch

## Sheet CAN.SchDoc
size A4
Used 2 times, as channels C1, C2. Parts and nets are listed once, with the designators drawn on the sheet.
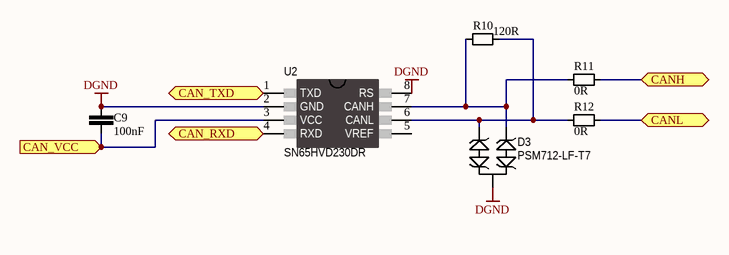
[diagram p6: CAN.SchDoc]

### Parts
C9  value 100nF  [0603-C]  (hidden comment: Cap)
D3  PSM712-LF-T7  [SOT-23_N]
R10  value 120R  [0603-R]  (hidden comment: Res)
R11  value 0R  [0603-R]  (hidden comment: Res)
R12  value 0R  [0603-R]  (hidden comment: Res)
U2  SN65HVD230DR  [SO-8_N]

### Ports
CAN_RXD (out), CAN_TXD (in), CAN_VCC (in), CANH (bidir), CANL (bidir)

### Nets
DGND: C9.2 D3.3 U2.2(GND) U2.8(RS)
CAN_RXD: U2.4(RXD) ; port CAN_RXD
CAN_TXD: U2.1(TXD) ; port CAN_TXD
CAN_VCC: C9.1 U2.3(VCC) ; port CAN_VCC
CANH: R11.2 ; port CANH
CANL: R12.2 ; port CANL
NetD3_1: D3.1 R10.1 R11.1 U2.7(CANH)
NetD3_2: D3.2 R10.2 R12.1 U2.6(CANL)

Not connected (* = marked no-connect by the designer): U2 5(VREF)

### Channels
C1: designators end in _C1; ports CAN_RXD=CAN_RXD1 CAN_TXD=CAN_TXD1 CAN_VCC=+3.3D CANH=CANH1 CANL=CANL1
C2: designators end in _C2; ports CAN_RXD=CAN_RXD2 CAN_TXD=CAN_TXD2 CAN_VCC=+3.3D1 CANH=CANH1 CANL=CANL1

### Library data of the parts
C9 = C21C100NK1H0: as C39 on sheet Top; Published: 1-Jun-2017; Publisher: GreenBox; MountType: SMT; PackageReference: 0603; Manufacturer: *
D3 = DT42PSM712LK: TVS PSM712-LF-T7 Vbr 7.5V, 13.3V Vc/Ipp 17V/34A, 30V/30A (3-1 3-2, 1-3 2-3); Manufacturer: PROTEK DEVICES; TemperatureRange: -55°C to 150°C; MountType: SMT; PackageReference: SOT-23; Published: 1-Jun-2017; Publisher: GreenBox; VenderID: PSM712-LF-T7
R10 = R11C120RFBF0: SMD Resistor 120R 1% 1/10W 0603 100PPM; TemperatureRange: -55°C to 150°C; VenderID: RES-0603-120R-1%; Published: 1-Jun-2017; Publisher: GreenBox; MountType: SMT; PackageReference: 0603; Manufacturer: *
R11 R12 = R11C000RFBF0: SMD Resistor 0R 1% 1/10W 0603 100PPM; TemperatureRange: -55°C to 150°C; VenderID: RES-0603-0R-1%; Published: 1-Jun-2017; Publisher: GreenBox; MountType: SMT; PackageReference: 0603; Manufacturer: *
U2 = U2S1VD230DRT: CAN Bus Transceivers SN65HVD230DR Vcc 3.3V; Manufacturer: TEXAS INSTRUMENTS; TemperatureRange: -40 to 85°C; MountType: SMT; PackageReference: SOIC-8; Published: 1-Jun-2017; Publisher: GreenBox; VenderID: SN65HVD230DR

## Sheet Audio.SchDoc
size A4
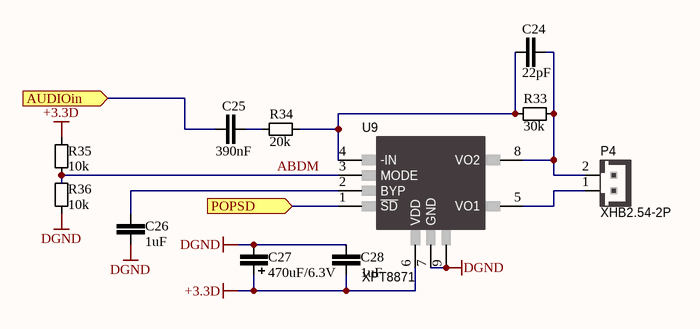
[diagram p7: Audio.SchDoc]

### Parts
C24  value 22pF  [0603-C]  (hidden comment: Cap)
C25  value 390nF  [0603-C]  (hidden comment: Cap)
C26  value 1uF  [0603-C]  (hidden comment: Cap)
C27  value 470uF/6.3V  [C-E-ALU-8X5]  (hidden comment: ECap)
C28  value 1uF  [0603-C]  (hidden comment: Cap)
P4  XHB2.54-2P  [XH-2]
R33  value 30k  [0603-R]  (hidden comment: Res)
R34  value 20k  [0603-R]  (hidden comment: Res)
R35  value 10k  [0603-R]  (hidden comment: Res)
R36  value 10k  [0603-R]  (hidden comment: Res)
U9  XPT8871  [SO-8_POWERPAD]

### Ports
AUDIOin (in), POPSD (in)

### Nets
+3.3D: C27.1 C28.2 R35.1 U9.6(VDD)
DGND: C26.2 C27.2 C28.1 R36.2 U9.7(GND) U9.9
ABDM: R35.2 R36.1 U9.3(MODE)
DAC_OUT1: C25.1 ; port AUDIOin
POPSD: U9.1(~{SD}) ; port POPSD
NetC24_1: C24.1 R33.1 R34.2 U9.4(-IN)
NetC24_2: C24.2 P4.2 R33.2 U9.8(VO2)
NetC25_2: C25.2 R34.1
NetC26_1: C26.1 U9.2(BYP)
NetP4_1: P4.1 U9.5(VO1)

### Library data of the parts
C24 = C11C022PJ1H0: as C1 on sheet Mcu; Published: 1-Jun-2017; Publisher: GreenBox; MountType: SMT; PackageReference: 0603; Manufacturer: *
C25 = C21C390NK1H0: MLCC 390nF 10% 50V X7R 0603; TemperatureRange: -55°C to 150°C; VenderID: MLCC-0603-50V-394K-X7R; Published: 1-Jun-2017; Publisher: GreenBox; MountType: SMT; PackageReference: 0603; Manufacturer: *
C26 C28 = C21C001UK1C0: MLCC 1uF 10% 16V X7R 0603; TemperatureRange: -55°C to 150°C; VenderID: MLCC-0603-16V-105K-X7R; Published: 1-Jun-2017; Publisher: GreenBox; MountType: SMT; PackageReference: 0603; Manufacturer: *
C27 = C3AD470UM0J0: DIP ECAP 470uF 20% 6.3V 8X5; TemperatureRange: -40°C to 105°C; VenderID: 470uF/6.3V 20% 8X5; Published: 1-Jun-2017; Publisher: GreenBox; MountType: DIP; PackageReference: 8X5; Manufacturer: *
P4 = P6DX02Z25400: as P1 on sheet Led; Manufacturer: *; MountType: DIP; PackageReference: XH2.54-2P; Published: 1-Jun-2017; Publisher: GreenBox; VenderID: XHB2.54-2P
R33 = R11C030KFBF0: as R43 on sheet Sensor; Published: 1-Jun-2017; Publisher: GreenBox; MountType: SMT; PackageReference: 0603; Manufacturer: *
R34 = R11C020KFBF0: as R22 on sheet Power; Published: 1-Jun-2017; Publisher: GreenBox; MountType: SMT; PackageReference: 0603; Manufacturer: *
R35 R36 = R11C010KFBF0: as R53 on sheet Top; Published: 1-Jun-2017; Publisher: GreenBox; MountType: SMT; PackageReference: 0603; Manufacturer: *
U9 = U1S1XPT88713: 1 channel audio amplifier XPT8871 5W; Manufacturer: XPTEK; TemperatureRange: -40 to 85°C; MountType: SMT; PackageReference: SOIC-8; Published: 1-Jun-2017; Publisher: GreenBox; VenderID: XPT8871

## Sheet Signal.SchDoc
size A4
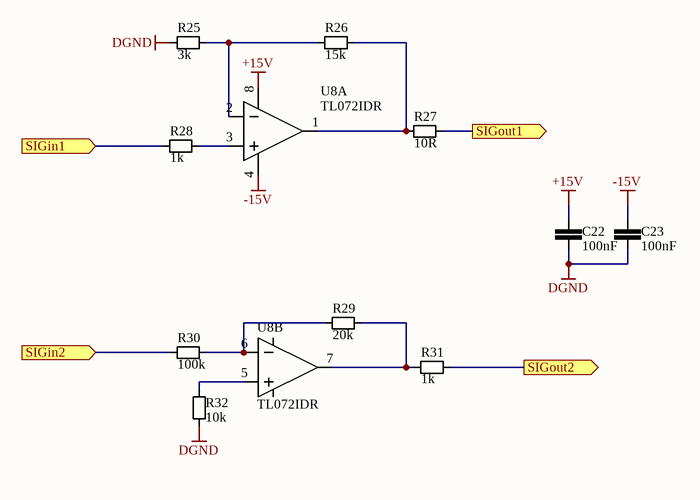
[diagram p8: Signal.SchDoc]

### Parts
C22  value 100nF  [0603-C]  (hidden comment: Cap)
C23  value 100nF  [0603-C]  (hidden comment: Cap)
R25  value 3k  [0603-R]  (hidden comment: Res)
R26  value 15k  [0603-R]  (hidden comment: Res)
R27  value 10R  [0603-R]  (hidden comment: Res)
R28  value 1k  [0603-R]  (hidden comment: Res)
R29  value 20k  [0603-R]  (hidden comment: Res)
R30  value 100k  [0603-R]  (hidden comment: Res)
R31  value 1k  [0603-R]  (hidden comment: Res)
R32  value 10k  [0603-R]  (hidden comment: Res)
U8  TL072IDR  [SO-8_N]  (parts A,B of 2)

### Ports
SIGin1 (in), SIGin2 (in), SIGout1 (out), SIGout2 (out)

### Nets
+15V: C22.1 U8.8
-15V: C23.1 U8.4
DGND: C22.2 C23.2 R25.2 R32.1
ADC_IN3: R31.2 ; port SIGout2
DAC_OUT2: R28.1 ; port SIGin1
NEG12IN: R30.2 ; port SIGin2
OR_OA: R27.2 ; port SIGout1
NetR25_1: R25.1 R26.1 U8.2
NetR26_2: R26.2 R27.1 U8.1
NetR28_2: R28.2 U8.3
NetR29_1: R29.1 R31.1 U8.7
NetR29_2: R29.2 R30.1 U8.6
NetR32_2: R32.2 U8.5

### Library data of the parts
C22 C23 = C21C100NK1H0: as C39 on sheet Top; Published: 1-Jun-2017; Publisher: GreenBox; MountType: SMT; PackageReference: 0603; Manufacturer: *
R25 = R11C003KFBF0: as R44 on sheet Sensor; Published: 1-Jun-2017; Publisher: GreenBox; MountType: SMT; PackageReference: 0603; Manufacturer: *
R26 = R11C015KFBF0: SMD Resistor 15k 1% 1/10W 0603 100PPM; TemperatureRange: -55°C to 150°C; VenderID: RES-0603-15k-1%; Published: 1-Jun-2017; Publisher: GreenBox; MountType: SMT; PackageReference: 0603; Manufacturer: *
R27 = R11C010RFBF0: SMD Resistor 10R 1% 1/10W 0603 100PPM; TemperatureRange: -55°C to 150°C; VenderID: RES-0603-10R-1%; Published: 1-Jun-2017; Publisher: GreenBox; MountType: SMT; PackageReference: 0603; Manufacturer: *
R28 R31 = R11C001KFBF0: as R21 on sheet Power; Published: 1-Jun-2017; Publisher: GreenBox; MountType: SMT; PackageReference: 0603; Manufacturer: *
R29 = R11C020KFBF0: as R22 on sheet Power; Published: 1-Jun-2017; Publisher: GreenBox; MountType: SMT; PackageReference: 0603; Manufacturer: *
R30 = R11C100KFBF0: as R20 on sheet Power; Published: 1-Jun-2017; Publisher: GreenBox; MountType: SMT; PackageReference: 0603; Manufacturer: *
R32 = R11C010KFBF0: as R53 on sheet Top; Published: 1-Jun-2017; Publisher: GreenBox; MountType: SMT; PackageReference: 0603; Manufacturer: *
U8 = UOS1TLC072IT: Dual Operational Amplifier TL072IDR Vcc ±18V Vio 3mV; Manufacturer: TEXAS INSTRUMENTS; TemperatureRange: -40°C to 85°C; Publisher: GreenBox; Published: 1-Jan-2016; PackageReference: SOIC(8); MountType: SMT; VenderID: TL072IDR; PackageDescription: 8-Pin Small Outline Integrated Circuit 1.27 mm Pitch

## Sheet Relay.SchDoc
size A4
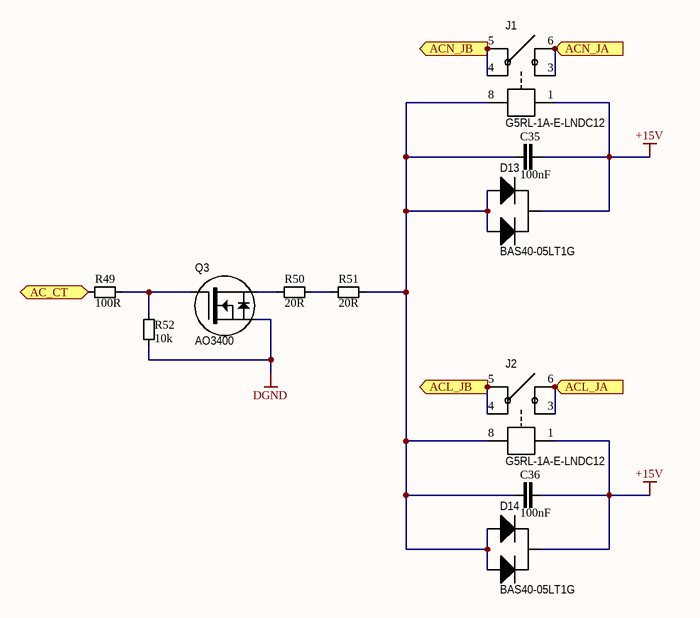
[diagram p9: Relay.SchDoc]

### Parts
C35  value 100nF  [0603-C]  (hidden comment: Cap)
C36  value 100nF  [0603-C]  (hidden comment: Cap)
D13  BAS40-05LT1G  [SOT-23_N]
D14  BAS40-05LT1G  [SOT-23_N]
J1  G5RL-1A-E-LNDC12  [G5RL-1A-E]
J2  G5RL-1A-E-LNDC12  [G5RL-1A-E]
Q3  AO3400  [SOT-23_N]
R49  value 100R  [0603-R]  (hidden comment: Res)
R50  value 20R  [1206-R]  (hidden comment: Res)
R51  value 20R  [1206-R]  (hidden comment: Res)
R52  value 10k  [0603-R]  (hidden comment: Res)

### Ports
AC_CT (in), ACL_JA (in), ACL_JB (out), ACN_JA (in), ACN_JB (out)

### Nets
+15V: C35.2 C36.2 D13.3 D14.3 J1.1 J2.1
DGND: Q3.2(S) R52.2
AC_CT: R49.1 ; port AC_CT
ACLin: J2.3 J2.6 ; port ACL_JA
ACLout: J2.4 J2.5 ; port ACL_JB
ACNin: J1.3 J1.6 ; port ACN_JA
ACNout: J1.4 J1.5 ; port ACN_JB
NetC35_1: C35.1 C36.1 D13.1 D13.2 D14.1 D14.2 J1.8 J2.8 R51.2
NetQ3_1: Q3.1(G) R49.2 R52.1
NetQ3_3: Q3.3(D) R50.1
NetR50_2: R50.2 R51.1

### Library data of the parts
C35 C36 = C21C100NK1H0: as C39 on sheet Top; Published: 1-Jun-2017; Publisher: GreenBox; MountType: SMT; PackageReference: 0603; Manufacturer: *
D13 D14 = D842BAS4005O: Dual Series Schottky Barrier Diode BAS40-05LT1G Vrrm 40V If 0.12A Ir 1uA; Manufacturer: ON SEMICONDUCTOR; TemperatureRange: -55 to 150°C; MountType: SMT; PackageReference: SOT-23; Published: 1-Jun-2017; Publisher: GreenBox; VenderID: BAS40-05LT1G
J1 J2 = JNDZG5RL1122: as J100 on sheet ORelay; MountType: DIP; PackageReference: G5RL-1A-E; Published: 1-Jun-2017; Publisher: GreenBox; VenderID: G5RL-1A-E-LNDC12
Q3 = QN42AO34000A: as Q100 on sheet ORelay; MountType: SMT; PackageReference: SOT-23; Published: 1-Jun-2017; Publisher: GreenBox; VenderID: AO3400
R49 = R11C100RFBF0: as R54 on sheet Top; Published: 1-Jun-2017; Publisher: GreenBox; MountType: SMT; PackageReference: 0603; Manufacturer: *
R50 R51 = R11E020RFDF0: as R17 on sheet Power; Published: 1-Jun-2017; Publisher: GreenBox; MountType: SMT; PackageReference: 1206; Manufacturer: *
R52 = R11C010KFBF0: as R53 on sheet Top; Published: 1-Jun-2017; Publisher: GreenBox; MountType: SMT; PackageReference: 0603; Manufacturer: *

## Sheet SampIO.SchDoc
size A4
Used 5 times, as channels S1, S2, S3, S4, S5. Parts and nets are listed once, with the designators drawn on the sheet.
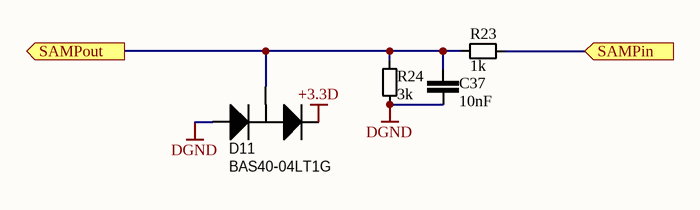
[diagram p10: SampIO.SchDoc]

### Parts
C37  value 10nF  [0603-C]  (hidden comment: Cap)
D11  BAS40-04LT1G  [SOT-23_N]
R23  value 1k  [0603-R]  (hidden comment: Res)
R24  value 3k  [0603-R]  (hidden comment: Res)

### Ports
SAMPin (in), SAMPout (out)

### Nets
+3.3D: D11.2(K)
DGND: C37.1 D11.1(A) R24.1
SAMPin: R23.2 ; port SAMPin
SAMPout: C37.2 D11.3(C) R23.1 R24.2 ; port SAMPout

### Channels
S1: designators end in _S1; ports SAMPin=SAMPIN1 SAMPout=ADC_IN2
S2: designators end in _S2; ports SAMPin=SAMPIN2 SAMPout=ADC_IN6
S3: designators end in _S3; ports SAMPin=SAMPIN3 SAMPout=ADC_IN7
S4: designators end in _S4; ports SAMPin=SAMPIN4 SAMPout=ADC_IN8
S5: designators end in _S5; ports SAMPin=SAMPIN5 SAMPout=ADC_IN9

### Library data of the parts
C37 = C21C010NK1H0: as C18 on sheet Power; Published: 1-Jun-2017; Publisher: GreenBox; MountType: SMT; PackageReference: 0603; Manufacturer: *
D11 = D742BAS4004O: as D12 on sheet Sensor; MountType: SMT; PackageReference: SOT-23; Published: 1-Jun-2017; Publisher: GreenBox; VenderID: BAS40-04LT1G
R23 = R11C001KFBF0: as R21 on sheet Power; Published: 1-Jun-2017; Publisher: GreenBox; MountType: SMT; PackageReference: 0603; Manufacturer: *
R24 = R11C003KFBF0: as R44 on sheet Sensor; Published: 1-Jun-2017; Publisher: GreenBox; MountType: SMT; PackageReference: 0603; Manufacturer: *

## Nets that join several sheets
+3.3D: Top (5 pins), Mcu (12 pins), Power (C19.1 C20.1 U7.2 U7.4), Sensor (10 pins), C1 (C9_C1.1 U2_C1.3), Audio (C27.1 C28.2 R35.1 U9.6), S1 (D11_S1.2), S2 (D11_S2.2), S3 (D11_S3.2), S4 (D11_S4.2), S5 (D11_S5.2)
+3.3D1: Top (J4.9 J4.12 Q4.3), C2 (C9_C2.1 U2_C2.3)
+15V: Led (P1.1 P2.1), Power (C13.1 D5.2 R19.1 R20.2), ORelay (R100.2), Signal (C22.1 U8.8), Relay (6 pins)
-15V: Power (C15.2 D9.1 D10.1), Signal (C23.1 U8.4)
DGND: Top (16 pins), Mcu (14 pins), Led (6 pins), Power (11 pins), ORelay (5 pins), Sensor (12 pins), C1 (C9_C1.2 D3_C1.3 U2_C1.2 U2_C1.8), C2 (C9_C2.2 D3_C2.3 U2_C2.2 U2_C2.8), Audio (6 pins), Signal (C22.2 C23.2 R25.2 R32.1), Relay (Q3.2 R52.2), S1 (C37_S1.1 D11_S1.1 R24_S1.1), S2 (C37_S2.1 D11_S2.1 R24_S2.1), S3 (C37_S3.1 D11_S3.1 R24_S3.1), S4 (C37_S4.1 D11_S4.1 R24_S4.1), S5 (C37_S5.1 D11_S5.1 R24_S5.1)
A0: Top (U11.11), Mcu (U1.20)
A1: Top (U11.10), Mcu (U1.21)
A2: Top (U11.9), Mcu (U1.22)
AC_CT: Mcu (U1.45), Relay (R49.1)
ACLin: Top (P6.1), Power (RT1.1), Sensor (H1.1), Relay (J2.3 J2.6)
ACLout: Top (P7.1), Relay (J2.4 J2.5)
ACNin: Top (P6.3), Power (C11.1 L1.3), Sensor (R37.1), Relay (J1.3 J1.6)
ACNout: Top (P7.3), Relay (J1.4 J1.5)
ADC_IN0: Mcu (U1.10), Sensor (C31.1 D12.3 R39.2 U10.1)
ADC_IN1: Mcu (U1.11), Sensor (C34.1 R47.2)
ADC_IN2: Mcu (U1.12), S1 (C37_S1.2 D11_S1.3 R23_S1.1 R24_S1.2)
ADC_IN3: Mcu (U1.13), Signal (R31.2)
ADC_IN6: Mcu (U1.16), S2 (C37_S2.2 D11_S2.3 R23_S2.1 R24_S2.2)
ADC_IN7: Mcu (U1.17), S3 (C37_S3.2 D11_S3.3 R23_S3.1 R24_S3.2)
ADC_IN8: Mcu (U1.18), S4 (C37_S4.2 D11_S4.3 R23_S4.1 R24_S4.2)
ADC_IN9: Mcu (U1.19), S5 (C37_S5.2 D11_S5.3 R23_S5.1 R24_S5.2)
CAN_RXD1: Mcu (U1.32), C1 (U2_C1.4)
CAN_RXD2: Top (J4.13), C2 (U2_C2.4)
CAN_TXD1: Mcu (U1.33), C1 (U2_C1.1)
CAN_TXD2: Top (J4.25), C2 (U2_C2.1)
CANH1: Top (P8.2), C1 (R11_C1.2), C2 (R11_C2.2)
CANL1: Top (P8.3), C1 (R12_C1.2), C2 (R12_C2.2)
CS: Top (J3.2), Mcu (U1.42)
DAC_OUT1: Mcu (U1.14), Audio (C25.1)
DAC_OUT2: Mcu (U1.15), Signal (R28.1)
LED1: Mcu (U1.26), Led (R5.1 R8.1)
LED2: Mcu (U1.27), Led (R2.1 R7.1)
NCARD: Top (J3.9), Mcu (U1.38)
NEG12IN: Top (J4.1), Signal (R30.2)
OR_I: Mcu (U1.46), ORelay (R13.1)
OR_OA: ORelay (U3.4), Signal (R27.2)
OR_OB: Top (J4.14), ORelay (U3.3)
POPSD: Mcu (U1.25), Audio (U9.1)
SAMPIN1: Top (U11.3), S1 (R23_S1.2)
SAMPIN2: Top (J4.6), S2 (R23_S2.2)
SAMPIN3: Top (J4.19), S3 (R23_S3.2)
SAMPIN4: Top (J4.7), S4 (R23_S4.2)
SAMPIN5: Top (J4.20), S5 (R23_S5.2)
SIMU_RST: Top (J4.23), Mcu (U1.30)
SIMU_SWCLK: Top (J4.11), Mcu (U1.31)
SIMU_SWDIO: Top (J4.10), Mcu (U1.29)
SPI1_MISO: Top (J3.7), Mcu (U1.40)
SPI1_MOSI: Top (J3.3), Mcu (U1.41)
SPI1_SCK: Top (J3.5), Mcu (U1.39)
VCC1PWR: Top (R53.2 R54.2), Mcu (U1.28)

## Assembly variants
Normal: not fitted M1 P1 P3 R40 R42 R44